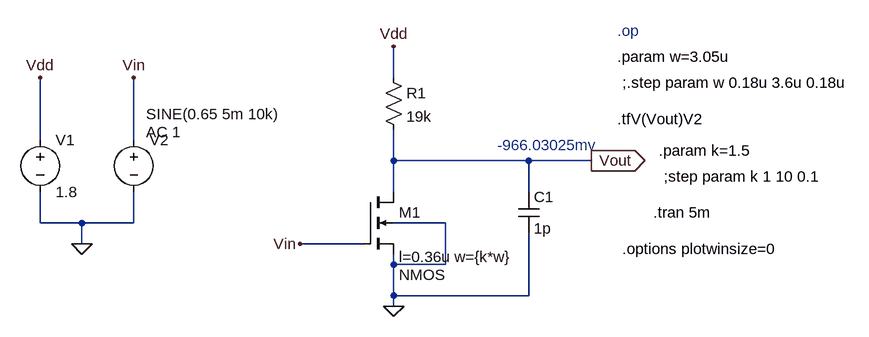
[diagram p0: schematic Cmos amplifier.asc]
Cmos amplifier.asc, the LTspice schematic file:
Version 4
SHEET 1 956 680
WIRE 224 -48 224 -96
WIRE -320 48 -320 -48
WIRE -176 48 -176 -48
WIRE 224 80 224 32
WIRE 432 80 224 80
WIRE 528 80 432 80
WIRE 224 128 224 80
WIRE 432 128 432 80
WIRE -320 176 -320 128
WIRE -256 176 -320 176
WIRE -176 176 -176 128
WIRE -176 176 -256 176
WIRE 304 176 224 176
WIRE -256 208 -256 176
WIRE 176 208 80 208
WIRE 224 240 224 224
WIRE 304 240 304 176
WIRE 304 240 224 240
WIRE 224 288 224 240
WIRE 432 288 432 192
WIRE 432 288 224 288
WIRE 224 304 224 288
FLAG 224 304 0
FLAG -256 208 0
FLAG 80 208 Vin
FLAG 528 80 Vout
IOPIN 528 80 Out
FLAG 224 -96 Vdd
FLAG -320 -48 Vdd
FLAG -176 -48 Vin
SYMBOL nmos4 176 128 R0
WINDOW 3 56 128 Left 2
WINDOW 123 56 100 Left 2
SYMATTR Value2 l=0.36u w={k*w}
SYMATTR InstName M1
SYMBOL res 208 -64 R0
SYMATTR InstName R1
SYMATTR Value 19k
SYMBOL cap 416 128 R0
SYMATTR InstName C1
SYMATTR Value 1p
SYMBOL voltage -320 32 R0
SYMATTR InstName V1
SYMATTR Value 1.8
SYMBOL voltage -176 32 R0
WINDOW 3 19 -24 Left 2
WINDOW 123 19 4 Left 2
WINDOW 39 0 0 Left 0
SYMATTR Value SINE(0.65 5m 10k)
SYMATTR Value2 AC 1
SYMATTR InstName V2
TEXT 568 -120 Left 2 ;.op
TEXT 568 -80 Left 2 !.param w=3.05u
TEXT 576 -40 Left 2 !;.step param w 0.18u 3.6u 0.18u
TEXT 568 16 Left 2 !.tfV(Vout)V2
TEXT 632 64 Left 2 !.param k=1.5
TEXT 640 104 Left 2 !;step param k 1 10 0.1
TEXT 384 56 Left 2 ;-966.03025mv
TEXT 624 160 Left 2 !.tran 5m
TEXT 576 216 Left 2 !.options plotwinsize=0

The netlist it stands for:
* Cmos amplifier.asc
M1 Vout Vin 0 0 NMOS l=0.36u w={k*w}
R1 Vdd Vout 19k
C1 Vout 0 1p
V1 Vdd 0 1.8
V2 Vin 0 SINE(0.65 5m 10k) AC 1
.model NMOS NMOS
.model PMOS PMOS
.lib standard.mos
* .op
.param w=3.05u
;.step param w 0.18u 3.6u 0.18u
.tfV(Vout)V2
.param k=1.5
;step param k 1 10 0.1
* -966.03025mv
.tran 5m
.options plotwinsize=0
.backanno
.end